# Altium schematic sheet BMS48Voltsv0.1.SchDoc
size A4; SheetNumber: 1; SheetTotal: 6
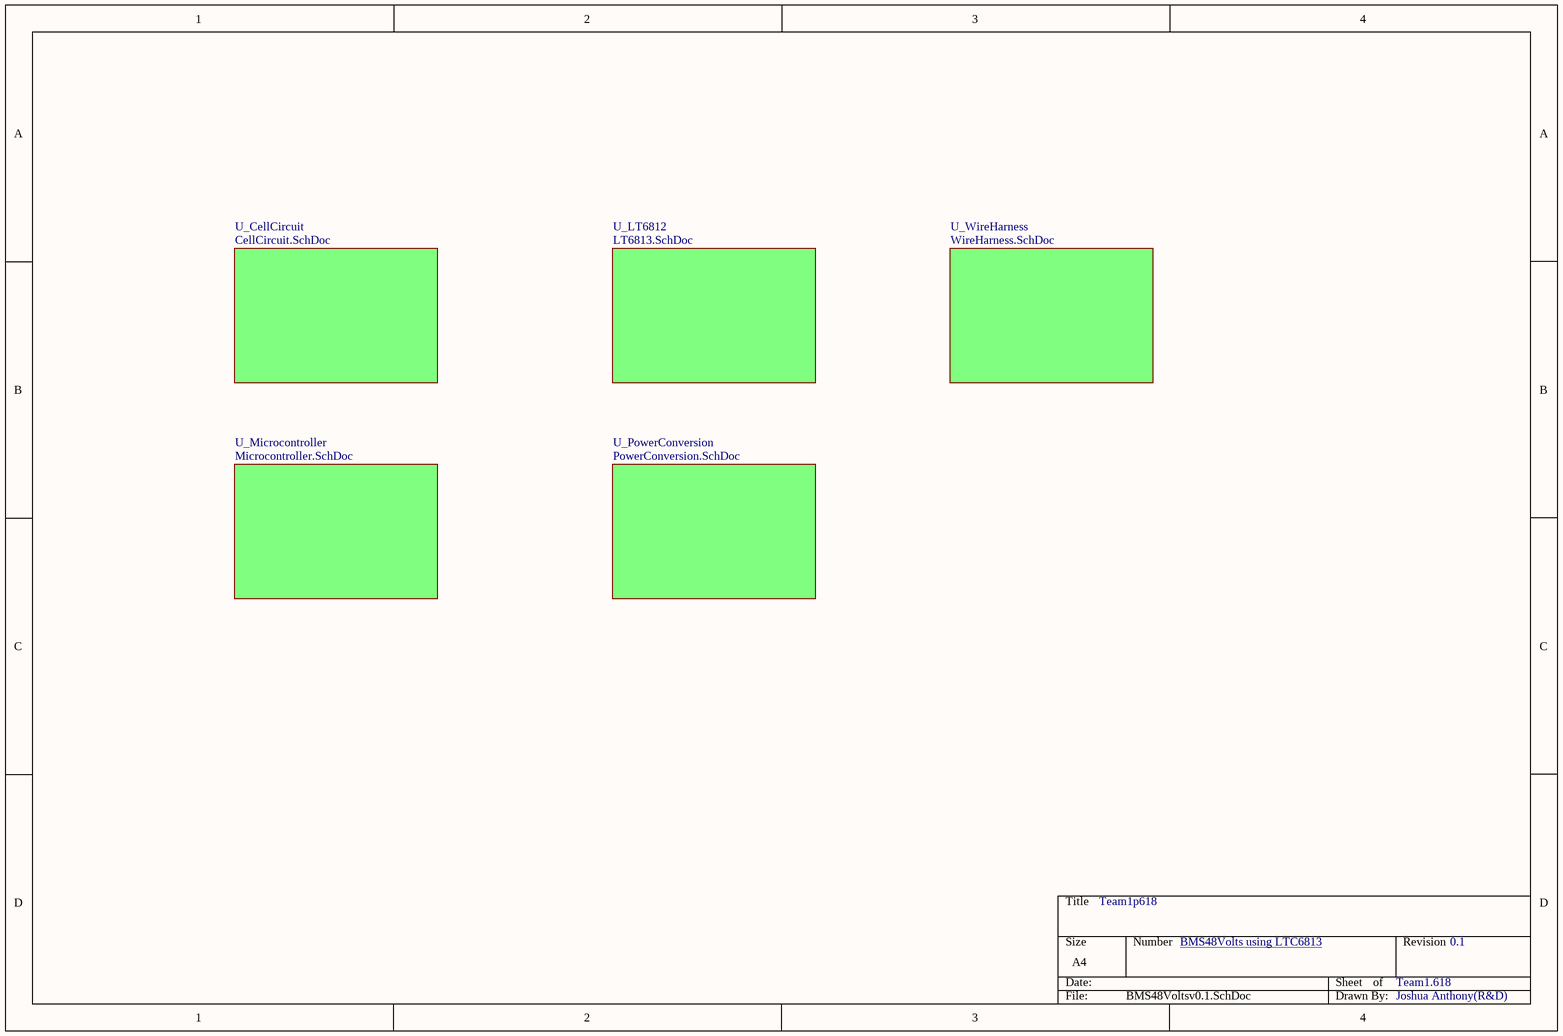
[diagram p0: BMS48Voltsv0.1.SchDoc]

## Sub-sheets
U_CellCircuit = CellCircuit.SchDoc: no entries
U_LT6812 = LT6813.SchDoc: no entries
U_Microcontroller = Microcontroller.SchDoc: no entries
U_PowerConversion = PowerConversion.SchDoc: no entries
U_WireHarness = WireHarness.SchDoc: no entries

## Notes on the sheet
- Team1p618
- BMS48Volts using LTC6813 <https://github.com/analogdevicesinc/Linduino/blob/master/LTSketchbook/libraries/LTC6813/LTC6813.cpp>
- Team1.618
- 0.1
- Joshua Anthony(R&D)